# EAGLE design ArgentINOedge (EAGLE 7.4.0)
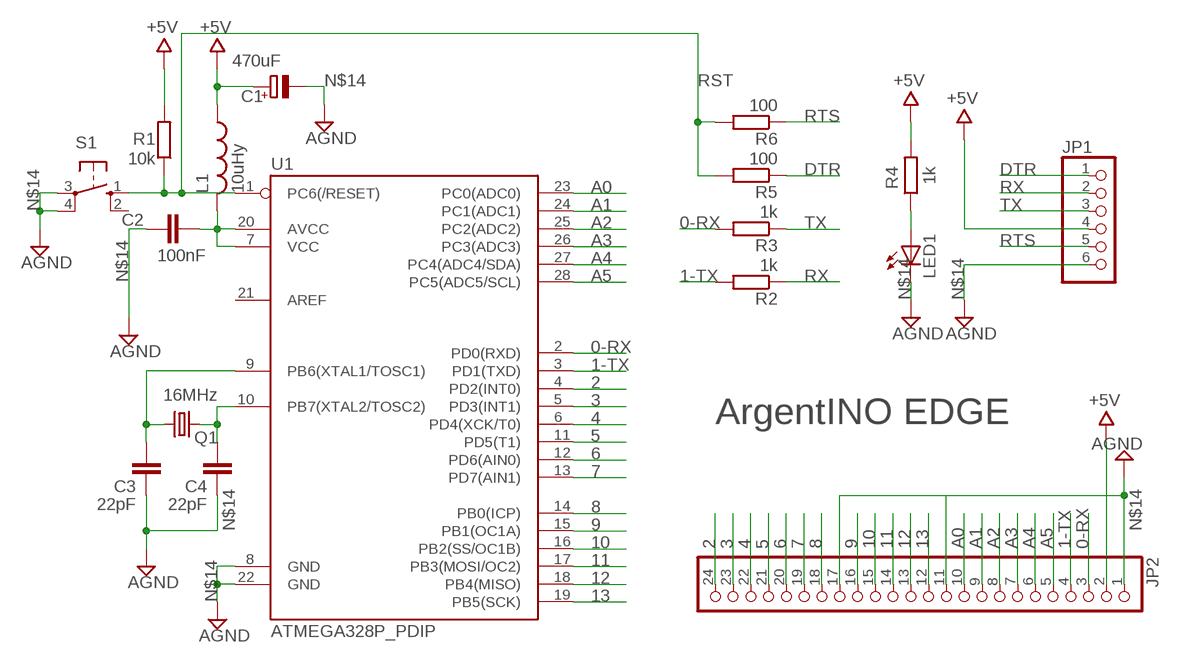
[diagram p0: schematic, sheet 1]

## Parts
C1  470uF  CPOL-EUE3.5-8  [E3,5-8]
C2  100nF  C-EU050-024X044  [C050-024X044]
C3  22pF  C-EU025-025X050  [C025-025X050]
C4  22pF  C-EU025-025X050  [C025-025X050]
JP1  PINHD-1X6  [1X06]
JP2  PINHD-1X24  [1X24]
L1  10uHy  L-US0204/7  [0204/7]
LED1  LED3MM  [LED3MM]
Q1  16MHz  CRYSTALHC49S  [HC49/S]
R1  10k  R-EU_0204/7  [0204/7]
R2  1k  R-EU_0204/7  [0204/7]
R3  1k  R-EU_0204/7  [0204/7]
R4  1k  R-EU_0204/7  [0204/7]
R5  100  R-EU_0204/7  [0204/7]
R6  100  R-EU_0204/7  [0204/7]
S1  10-XX  [B3F-10XX]
U1  ATMEGA328P_PDIP  [DIL28-3]

## Nets
0-RX: JP2.3 R3.2 U1.2(PD0(RXD))
1-TX: JP2.4 R2.2 U1.3(PD1(TXD))
2: JP2.24 U1.4(PD2(INT0))
3: JP2.23 U1.5(PD3(INT1))
4: JP2.22 U1.6(PD4(XCK/T0))
5: JP2.21 U1.11(PD5(T1))
6: JP2.20 U1.12(PD6(AIN0))
7: JP2.19 U1.13(PD7(AIN1))
8: JP2.18 U1.14(PB0(ICP))
9: JP2.16 U1.15(PB1(OC1A))
10: JP2.15 U1.16(PB2(SS/OC1B))
11: JP2.14 U1.17(PB3(MOSI/OC2))
12: JP2.13 U1.18(PB4(MISO))
13: JP2.12 U1.19(PB5(SCK))
+5V: C1.+ JP1.4 JP2.2 L1.1 R1.2 R4.2
A0: JP2.10 U1.23(PC0(ADC0))
A1: JP2.9 U1.24(PC1(ADC1))
A2: JP2.8 U1.25(PC2(ADC2))
A3: JP2.7 U1.26(PC3(ADC3))
A4: JP2.6 U1.27(PC4(ADC4/SDA))
A5: JP2.5 U1.28(PC5(ADC5/SCL))
DTR: JP1.1 R5.1
N$1: C3.2 Q1.2 U1.9(PB6(XTAL1/TOSC1))
N$2: C4.2 Q1.1 U1.10(PB7(XTAL2/TOSC2))
N$3: C2.1 L1.2 U1.7(VCC) U1.20(AVCC)
N$14: C1.- C2.2 C3.1 C4.1 JP1.6 JP2.1 JP2.11 JP2.17 LED1.K(C) S1.3(P) S1.4(P1) U1.8(GND) U1.22(GND) ; supply symbol labelled AGND
N$40: LED1.A R4.1
RST: R1.1 R5.2 R6.2 S1.1(S) U1.1(PC6(/RESET))
RTS: JP1.5 R6.1
RX: JP1.2 R2.1
TX: JP1.3 R3.1
Unconnected: S1.2(S1) U1.21(AREF)

## Notes on the sheet
- ArgentINO EDGE

## Library data of the parts
C1 = rcl:CPOL-EU: POLARIZED CAPACITOR, European symbol
C2-C4 = rcl:C-EU: CAPACITOR, European symbol
JP1 = pinhead:PINHD-1X6: PIN HEADER
JP2 = pinhead:PINHD-1X24: PIN HEADER
L1 = rcl:L-US: INDUCTOR, American symbol
LED1 = led:LED: LED OSRAM: - CHIPLED LG R971, LG N971, LY N971, LG Q971, LY Q971, LO R971, LY R971 LH N974, LH R974 LS Q976, LO Q976, LY Q976 LO Q996 - Hyper CHIPLED LW Q18S LB Q993, LB Q99A, LB R99A - SideLED LS A670, LO A670, LY A670, LG A670, LP A670 LB A673, LV A673, LT A673, LW A673 LH A674 LY A675 LS A676, LA A676, LO A676, LY A676, LW A676 LS A679, LY A679, LG A679 - Hyper Micro SIDELED® LS Y876, LA Y876, LO Y876, LY Y876 LT Y87S - SmartLED LW L88C, LW L88S LB L89C, LB L89S, LG L890 LS L89K, LO L89K, LY L89K LS L896, LA L896, LO L896, LY L896 - TOPLED LS T670, LO T670, LY T670, LG T670, LP T670 LSG T670, LSP T670, LSY T670, LOP T670, LYG T670 LG T671, LOG T671, LSG T671 LB T673, LV T673, LT T673, LW T673 LH T674 LS T676, LA T676, LO T676, LY T676, LB T676, LH T676, LSB T676, LW T676 LB T67C, LV T67C, LT T67C, LS T67K, LO T67K, LY T67K, LW E67C LS E67B, LA E67B, LO E67B, LY E67B, LB E67C, LV E67C, LT E67C LW T67C LS T679, LY T679, LG T679 LS T770, LO T770, LY T770, LG T770, LP T770 LB T773, LV T773, LT T773, LW T773 LH T774 LS E675, LA E675, LY E675, LS T675 LS T776, LA T776, LO T776, LY T776, LB T776 LHGB T686 LT T68C, LB T68C - Hyper Mini TOPLED® LB M676 - Mini TOPLED Santana® LG M470 LS M47K, LO M47K, LY M47K Source: http://www.osram.convergy.de LUXEON: - LUMILED® LXK2-PW12-R00, LXK2-PW12-S00, LXK2-PW14-U00, LXK2-PW14-V00 LXK2-PM12-R00, LXK2-PM12-S00, LXK2-PM14-U00 LXK2-PE12-Q00, LXK2-PE12-R00, LXK2-PE12-S00, LXK2-PE14-T00, LXK2-PE14-U00 LXK2-PB12-K00, LXK2-PB12-L00, LXK2-PB12-M00, LXK2-PB14-N00, LXK2-PB14-P00, LXK2-PB14-Q00 LXK2-PR12-L00, LXK2-PR12-M00, LXK2-PR14-Q00, LXK2-PR14-R00 LXK2-PD12-Q00, LXK2-PD12-R00, LXK2-PD12-S00 LXK2-PH12-R00, LXK2-PH12-S00 LXK2-PL12-P00, LXK2-PL12-Q00, LXK2-PL12-R00 Source: www.luxeon.com KINGBRIGHT: KA-3528ASYC Source: www.kingbright.com
Q1 = crystal:CRYSTAL: CRYSTAL; OC_FARNELL: 1667008; OC_NEWARK: unknown
R1-R6 = rcl:R-EU_: RESISTOR, European symbol
S1 = switch-omron:10-XX: OMRON SWITCH; MPN: B3F-1000; OC_FARNELL: 176432; OC_NEWARK: 36M3542
U1 = SparkFun-DigitalIC:ATMEGA328P_PDIP: uC used in the Arduino 32kb flash, 1k EEPROM, 2k SRAM This is the through-hole version of this chip.

## Board
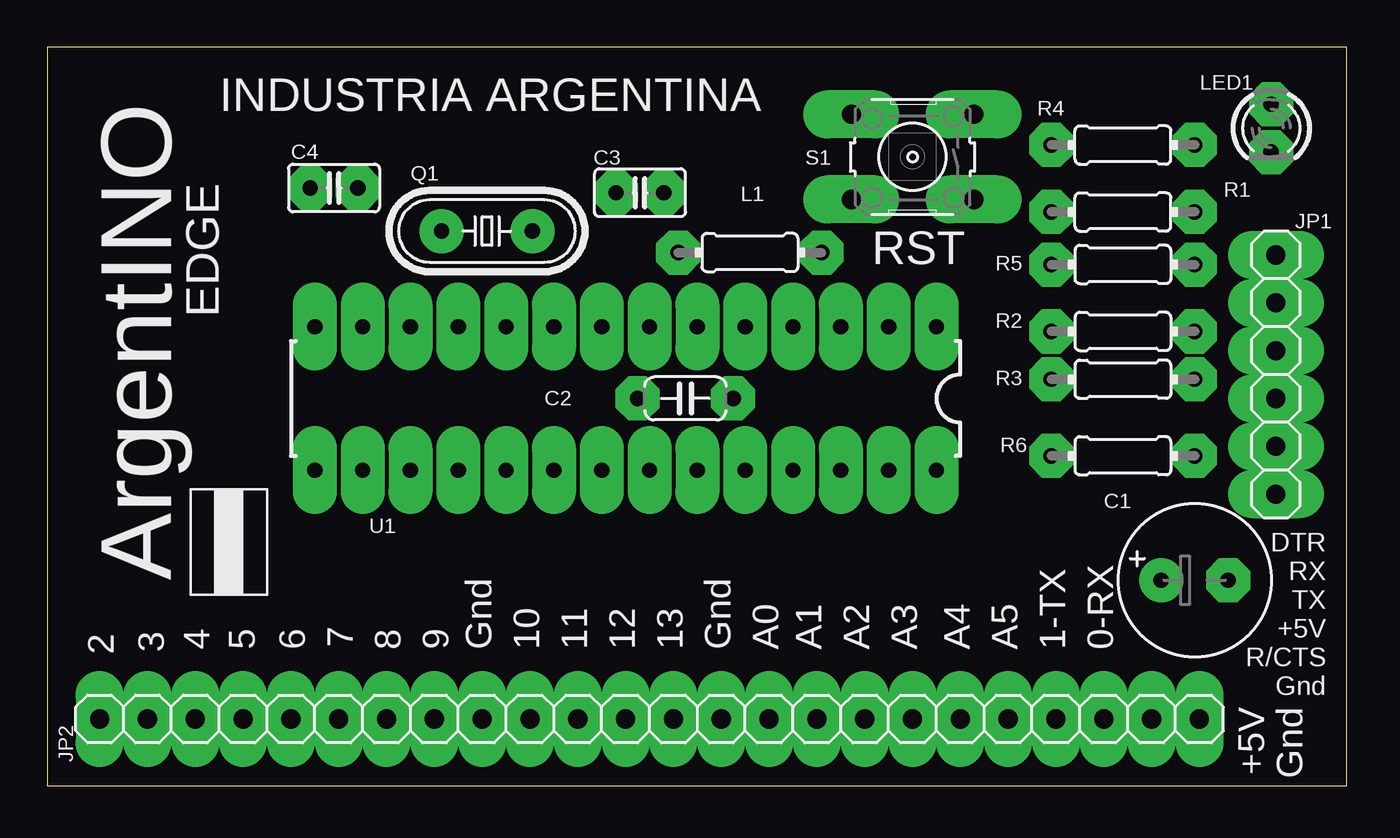
[diagram p1: board, top side]
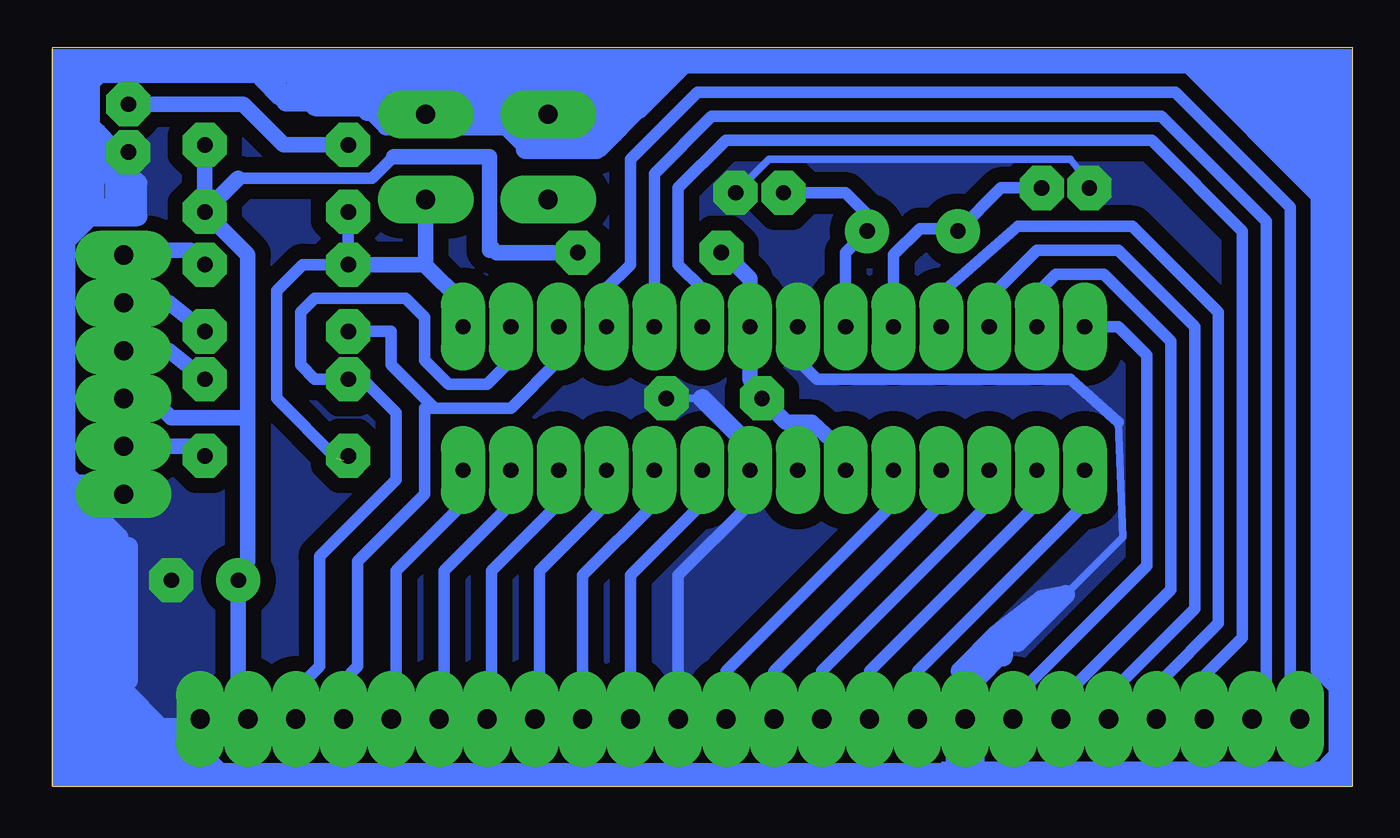
[diagram p2: board, bottom side, seen from below]

Size 69.04 x 39.24 mm. Coordinates in mm from the lower left corner, seen from the top.
Outline: 69.04,0 69.04,39.24 0,39.24 0,0 69.04,0
Copper layers (1*16): Top 0.035mm / dielectric 1.5mm / Bottom 0.035mm
Design rules "default *": minimum track width 10mil, minimum drill 24mil, track to track 8mil, track to pad 8mil, pad to pad 8mil, via to via 8mil, smd to smd 8mil, copper to edge 40mil, drill to drill 8mil, minimum pad ring 30mil, minimum via ring 8mil, stop-mask expansion 4mil, vias tented up to drill 0mil, thermal gap 20mil

### Footprints (pad centres in the part's own frame; a part is rotated, then mirrored left to right if it is on the bottom)
E3,5-8 = drill 0.813 pad 1.6: + -1.778,0 | drill 0.813 pad 1.6 octagon: - 1.778,0
C050-024X044 = drill 0.813 octagon: 1 -2.54,0; 2 2.54,0
C025-025X050 = drill 0.813 octagon: 1 -1.27,0; 2 1.27,0
1X06 = drill 1.016 long: 1 -6.35,0; 2 -3.81,0; 3 -1.27,0; 4 1.27,0; 5 3.81,0; 6 6.35,0
1X24 = drill 1.016 long: 1 -29.21,0; 2 -26.67,0; 3 -24.13,0; 4 -21.59,0; 5 -19.05,0; 6 -16.51,0; 7 -13.97,0; 8 -11.43,0; 9 -8.89,0; 10 -6.35,0; 11 -3.81,0; 12 -1.27,0; 13 1.27,0; 14 3.81,0; 15 6.35,0; 16 8.89,0; 17 11.43,0; 18 13.97,0; 19 16.51,0; 20 19.05,0; 21 21.59,0; 22 24.13,0; 23 26.67,0; 24 29.21,0
0204/7 = drill 0.813 octagon: 1 -3.81,0; 2 3.81,0
LED3MM = drill 0.813 octagon: A -1.27,0; K 1.27,0
HC49/S = drill 0.813: 1 -2.413,0; 2 2.413,0
B3F-10XX = drill 1.016 long: 1 -3.251,2.261; 2 3.251,2.261; 3 -3.251,-2.261; 4 3.251,-2.261
DIL28-3 = drill 0.813 long: 1 -16.51,-3.81; 2 -13.97,-3.81; 3 -11.43,-3.81; 4 -8.89,-3.81; 5 -6.35,-3.81; 6 -3.81,-3.81; 7 -1.27,-3.81; 8 1.27,-3.81; 9 3.81,-3.81; 10 6.35,-3.81; 11 8.89,-3.81; 12 11.43,-3.81; 13 13.97,-3.81; 14 16.51,-3.81; 15 16.51,3.81; 16 13.97,3.81; 17 11.43,3.81; 18 8.89,3.81; 19 6.35,3.81; 20 3.81,3.81; 21 1.27,3.81; 22 -1.27,3.81; 23 -3.81,3.81; 24 -6.35,3.81; 25 -8.89,3.81; 26 -11.43,3.81; 27 -13.97,3.81; 28 -16.51,3.81

### Placement (x,y rotation side)
C1  60.96,10.93 0 top
C2  33.91,20.58 0 top
C3  31.5,31.51 180 top
C4  15.24,31.76 0 top
JP1  65.28,21.85 270 top
JP2  32,3.57 180 top
L1  37.34,28.33 180 top
LED1  65.02,34.94 270 top
Q1  23.37,29.47 0 top
R1  57.15,30.49 0 top
R2  57.15,24.14 180 top
R3  57.15,21.6 180 top
R4  57.15,34.05 0 top
R5  57.15,27.7 180 top
R6  57.15,17.54 180 top
S1  45.97,33.41 180 top
U1  30.73,20.58 180 top

### Tracks (layer width: path | path; a pad name or v marks a point on that pad's centre or on a via)
0-RX
  Bottom 0.61: U1.2 44.7,22.62 45.97,21.35 48.01,21.35 49.28,22.62 49.28,24.9 50.29,25.92 55.12,25.92 55.88,25.16 55.88,22.36 55.12,21.6 R3.2 52.58,21.6 50.8,19.82 50.8,16.27 54.86,12.2 54.86,6.36 56.13,5.09 JP2.3
1-TX
  Bottom 0.61: U1.3 42.16,22.62 44.7,20.08 48.77,20.08 | 48.77,20.08 49.28,20.08 49.28,15.5 52.83,11.95 52.83,6.36 53.59,5.6 JP2.4 | 48.77,20.08 51.05,22.36 51.05,24.14 R2.2
2
  Bottom 0.61: U1.4 39.62,26.43 38.35,27.7 38.35,33.28 34.8,36.84 9.4,36.84 3.3,30.74 3.3,5.09 2.79,4.58 JP2.24
3
  Bottom 0.61: JP2.23 5.59,4.58 4.57,5.34 4.57,29.98 10.16,35.57 34.04,35.57 37.08,32.52 U1.5
4
  Bottom 0.61: JP2.22 7.87,5.85 5.84,7.88 5.84,29.47 10.67,34.3 33.27,34.3 35.81,31.76 35.81,27.7 34.54,26.43 U1.6
5
  Bottom 0.61: U1.11 21.84,26.17 17.78,29.73 11.68,29.73 7.11,25.16 7.11,8.65 10.16,5.6 10.41,4.84 JP2.21
6
  Bottom 0.61: U1.12 19.3,25.92 16.76,28.46 12.45,28.46 8.38,24.39 8.38,9.41 12.95,4.84 JP2.20
7
  Bottom 0.61: U1.13 16.76,26.17 15.75,27.19 13.21,27.19 9.65,23.63 9.65,10.42 15.49,4.58 JP2.19
8
  Bottom 0.61: U1.14 12.45,24.39 10.92,22.87 10.92,11.69 18.03,4.58 JP2.18
9
  Bottom 0.61: U1.15 14.22,15 23.11,6.11 JP2.16
10
  Bottom 0.61: U1.16 16.76,15 25.65,6.11 JP2.15
11
  Bottom 0.61: U1.17 19.3,15 28.19,6.11 JP2.14
12
  Bottom 0.61: U1.18 21.84,15 30.73,6.11 JP2.13
13
  Bottom 0.61: U1.19 24.38,15 33.27,6.11 JP2.12
+5V
  Bottom 0.61: 50.93,33.41 52.07,32.27 59.18,32.27
  Bottom 0.813: R4.2 R1.2 | 58.67,19.57 58.67,28.2 R1.2 | 58.67,19.57 62.74,19.57 63.75,20.58 JP1.4 | 58.67,19.57 58.67,11.95 C1.+ 59.18,4.07 JP2.2 | 45.85,28.46 45.85,28.71 | 45.85,28.71 45.85,33.41 50.93,33.41 | 59.18,32.27 R1.2 | L1.1 45.47,28.33 45.85,28.71
A0
  Bottom 0.61: U1.23 34.54,15 38.35,11.19 JP2.10
A1
  Bottom 0.61: U1.24 37.08,15 40.89,11.19 JP2.9
A2
  Bottom 0.61: U1.25 39.62,15 43.18,11.44 43.18,3.82 JP2.8
A3
  Bottom 0.61: U1.26 42.16,15 45.72,11.44 45.72,3.82 JP2.7
A4
  Bottom 0.61: U1.27 44.7,15 48.26,11.44 48.26,3.82 JP2.6
A5
  Bottom 0.61: U1.28 47.24,15 50.8,11.44 50.8,3.82 JP2.5
DTR
  Bottom 0.813: R5.1 61.72,28.46 65.02,28.46 JP1.1 65.41,27.7
N$1
  Bottom 0.61: C3.2 26.92,31.51 25.78,30.36 Q1.2 26.92,28.33 U1.9
N$2
  Bottom 0.61: U1.10 24.38,28.2 22.99,29.6 20.95,29.6 Q1.1 18.67,31.76 C4.2
N$3
  Bottom 0.813: U1.20 26.92,17.66 28.7,19.31 30.1,19.31 C2.1 32,21.6 U1.7 32,26.93 33.4,28.33 L1.2
N$4
  Bottom 1.016: 41.66,34.3 40.39,35.57 40.39,35.82
N$5
  Bottom 1.016: 19.56,7.12 20.57,6.11 20.83,6.11
N$6
  Bottom 0.406: 37.34,37.09 36.83,37.09 35.81,38.11 35.81,38.36 36.07,38.36 36.83,37.6 38.86,37.6 38.86,37.35 40.89,37.35 41.4,37.86 39.37,37.86 39.12,37.86
N$7
  Bottom 1.016: 55.88,36.33 55.88,36.59 56.9,36.59 57.91,37.6 57.4,38.11
N$8
  Bottom 1.016: 56.64,36.33 55.63,36.33 54.36,37.09 54.86,36.08 54.61,36.08 54.61,36.33 54.36,36.59
N$9
  Bottom 1.016: 55.12,36.08 52.58,36.08 52.32,35.82
N$10
  Bottom 1.016: 52.32,36.08 51.31,35.06 48.01,35.06 49.28,35.82 51.56,36.08 51.31,36.33
N$11
  Bottom 1.016: 45.72,35.57 45.97,35.32 45.47,37.09 46.99,35.82 | 46.99,35.82 46.48,35.57 46.74,35.82 46.99,35.82
N$12
  Bottom 1.016: 37.59,36.33 40.13,33.79 43.69,33.79 | 43.69,33.79 43.94,33.79 | 43.69,33.79 44.96,35.06
N$13
  Bottom 1.016: 20.83,5.6 20.83,5.09
N$14
  Bottom 0.406: 9.14,38.62 8.89,38.62 | 8.89,38.62 1.27,31 1.27,31.25 1.02,31.51 1.27,31.51 7.87,38.11 7.37,38.11 1.27,32.01 | 1.27,32.01 1.27,32.52 6.86,38.11 6.35,38.11 1.27,33.03 1.27,33.54 5.84,38.11 5.59,38.11 4.32,36.84 | 4.32,36.84 1.27,33.79 1.27,34.3 5.08,38.11 4.32,36.84 | 4.32,36.84 1.02,34.55 1.02,35.06 4.06,36.84 3.05,36.84 1.27,35.82 1.27,36.33 3.3,37.35 2.79,38.36 1.02,36.59 1.02,36.84 2.54,38.36 2.03,38.36 1.52,37.86 | 1.52,37.86 1.27,37.6 1.27,37.86 1.52,38.11 | 8.89,38.62 8.64,38.62 1.02,31 1.52,31 3.3,32.78 3.3,36.08 1.52,37.86 | 1.52,31.51 1.52,6.11 | 1.52,6.11 1.27,5.85 1.27,6.11 | 1.27,6.11 1.78,6.61 1.78,31 2.03,31.25 | JP2.17 20.57,4.58 20.57,4.84 18.54,6.87 15.24,10.17 12.19,13.22 12.45,19.31 | C4.1 13.97,32.01 14.99,33.28 30.99,33.28 C3.1 | S1.4 37.74,35.67 35.31,38.11 | 35.05,38.36 35.31,38.11 | 35.31,38.11 8.89,38.11 2.03,31.25 | 2.03,6.61 2.03,6.11 1.02,5.09 1.02,1.79 2.03,0.77 25.4,0.77 | 2.03,31.25 2.03,6.61 | 2.03,6.61 1.52,6.11 | 1.27,6.11 1.27,8.14 | 1.52,37.86 1.52,8.39 1.27,8.14 | 1.27,8.14 1.27,16.77 | 1.27,16.77 1.02,17.03 | 1.27,16.77 1.27,32.01 | 21.08,1.03 60.71,1.03 62.74,3.06 62.74,2.8 60.96,1.03 61.21,1.03 62.48,2.3 62.48,1.79 61.72,1.03 61.98,1.03 62.99,2.04 62.99,1.53 | 62.99,1.53 62.48,1.28 62.74,1.28 | 62.74,1.28 62.99,1.53 | 62.99,1.53 63.25,1.79 | 62.74,1.28 62.48,1.03 64.01,1.03 65.02,2.04 | C2.2 34.54,20.58 | 32,18.04 U1.22
  Bottom 0.61: LED1.K 65.02,33.79 65.15,33.79 68.2,30.74 68.2,5.73 65.79,3.31 61.21,3.31 60.96,3.57 60.96,1.79 59.94,0.77 36.58,0.77 35.56,1.79 35.56,3.31 JP2.11 | U1.8 29.46,22.62 28.45,21.6 14.99,21.6 12.45,19.31 | U1.22 32,15 35.81,11.19 35.81,3.31 36.07,3.06 36.07,1.53 35.31,0.77 25.4,0.77 21.34,0.77 21.08,1.03 20.57,1.28 JP2.17
  Bottom 0.813: 49.02,36.59 49.28,36.59 | 49.28,36.59 50.04,36.59 50.8,35.82 50.55,35.82 | S1.3 49.23,35.77 49.28,35.82 49.28,36.59
  Bottom 1.016: 20.83,6.11 18.8,8.14 | 18.8,8.14 19.3,7.12 | 62.74,1.28 62.74,2.55 65.79,5.6 | 65.79,5.6 65.79,5.09 | 65.79,5.09 65.79,3.31 65.02,2.55 64.01,2.55 | 63.5,2.55 64.01,2.55 | 64.01,2.55 65.02,3.57 65.02,4.33 65.79,5.09 | 65.79,5.6 65.79,11.95 65.02,12.71 65.02,5.6 65.53,5.09 65.53,13.22 66.8,14.49 66.8,12.2 66.55,11.95 66.55,13.22 66.29,13.47 66.29,14.49 68.33,16.52 68.33,28.97 67.06,30.24 64.52,30.24 64.52,32.01 65.79,33.28 65.79,31 66.04,30.74 65.79,30.74 65.53,30.49 65.53,33.54 67.06,35.06 67.06,37.35 66.55,37.86 57.91,37.86 56.39,36.33 56.39,36.84 55.37,37.86 55.37,37.09 55.12,36.84 52.83,36.84 | 50.8,36.84 38.1,36.84 | 37.34,36.84 38.1,36.84 | 38.1,36.84 38.61,36.33 37.85,36.33 37.59,36.59 49.02,36.59 50.8,36.84 | 50.8,36.84 52.83,36.84 | 52.83,36.84 54.1,38.11 | 20.57,4.58 20.07,5.09 20.07,5.6 | 20.07,5.6 20.07,6.61 | 20.07,5.6 18.54,7.12 | 18.8,8.14 16.51,9.92 15.24,10.17 17.78,7.63 18.54,7.63 18.54,7.12 | 18.54,7.12 18.54,6.87 | 34.54,20.58 32,18.04
  pour Bottom (isolate 0.813, no thermals): 0,39.25 69.21,39.25 69.21,0.01 0,0.01
N$15
  Bottom 1.016: 40.39,34.55 40.64,34.3 43.18,34.3 43.69,34.81 43.94,34.81
N$40
  Bottom 0.813: R4.1 56.77,34.05 58.93,36.21 LED1.A
RST  (1 unrouted)
  Bottom 0.406: 49.23,27.75 49.28,27.7
  Bottom 0.61: R1.1 R5.2 | R5.2 53.34,27.61 53.49,27.76 | 53.95,17.38 57.15,20.58 57.15,26.3 55.75,27.7 R5.2 | U1.1 47.24,25.66 | 53.59,17.28 R6.2
  Bottom 0.813: 47.24,25.66 49.28,27.7 R5.2 | S1.1 49.23,27.75
RTS
  Bottom 0.813: R6.1 61.21,17.79 61.21,18.04 JP1.5
RX
  Bottom 0.813: R2.1 62.87,25.66 JP1.2
S$1
  Bottom 0.61: 50.8,3.82 51.05,3.57
S$4
  Bottom 0.61: 33.27,3.57 33.27,6.11
S$10
  Bottom 0.61: 48.26,3.82 48.51,3.57
S$16
  Bottom 0.61: 43.18,3.82 43.43,3.57
S$18
  Bottom 0.61: 45.72,3.82 45.97,3.57
TX
  Bottom 0.813: R3.1 62.87,23.12 JP1.3
(copper drawn outside any net)
  shapes: Bottom area x44

### Text on the board
tNames: INDUSTRIA ARGENTINA | RST | EDGE | DTR | RX | ArgentINO | TX | +5V | 2 | 3 | 4 | 5 | 6 | 7 | 8 | 9 | Gnd | 10 | 11 | 12 | 13 | Gnd | A0 | A1 | A2 | A3 | A4 | A5 | 1-TX | 0-RX | R/CTS | Gnd | +5V | Gnd